# Altium schematic sheet INPUT_Module.SchDoc
size A2
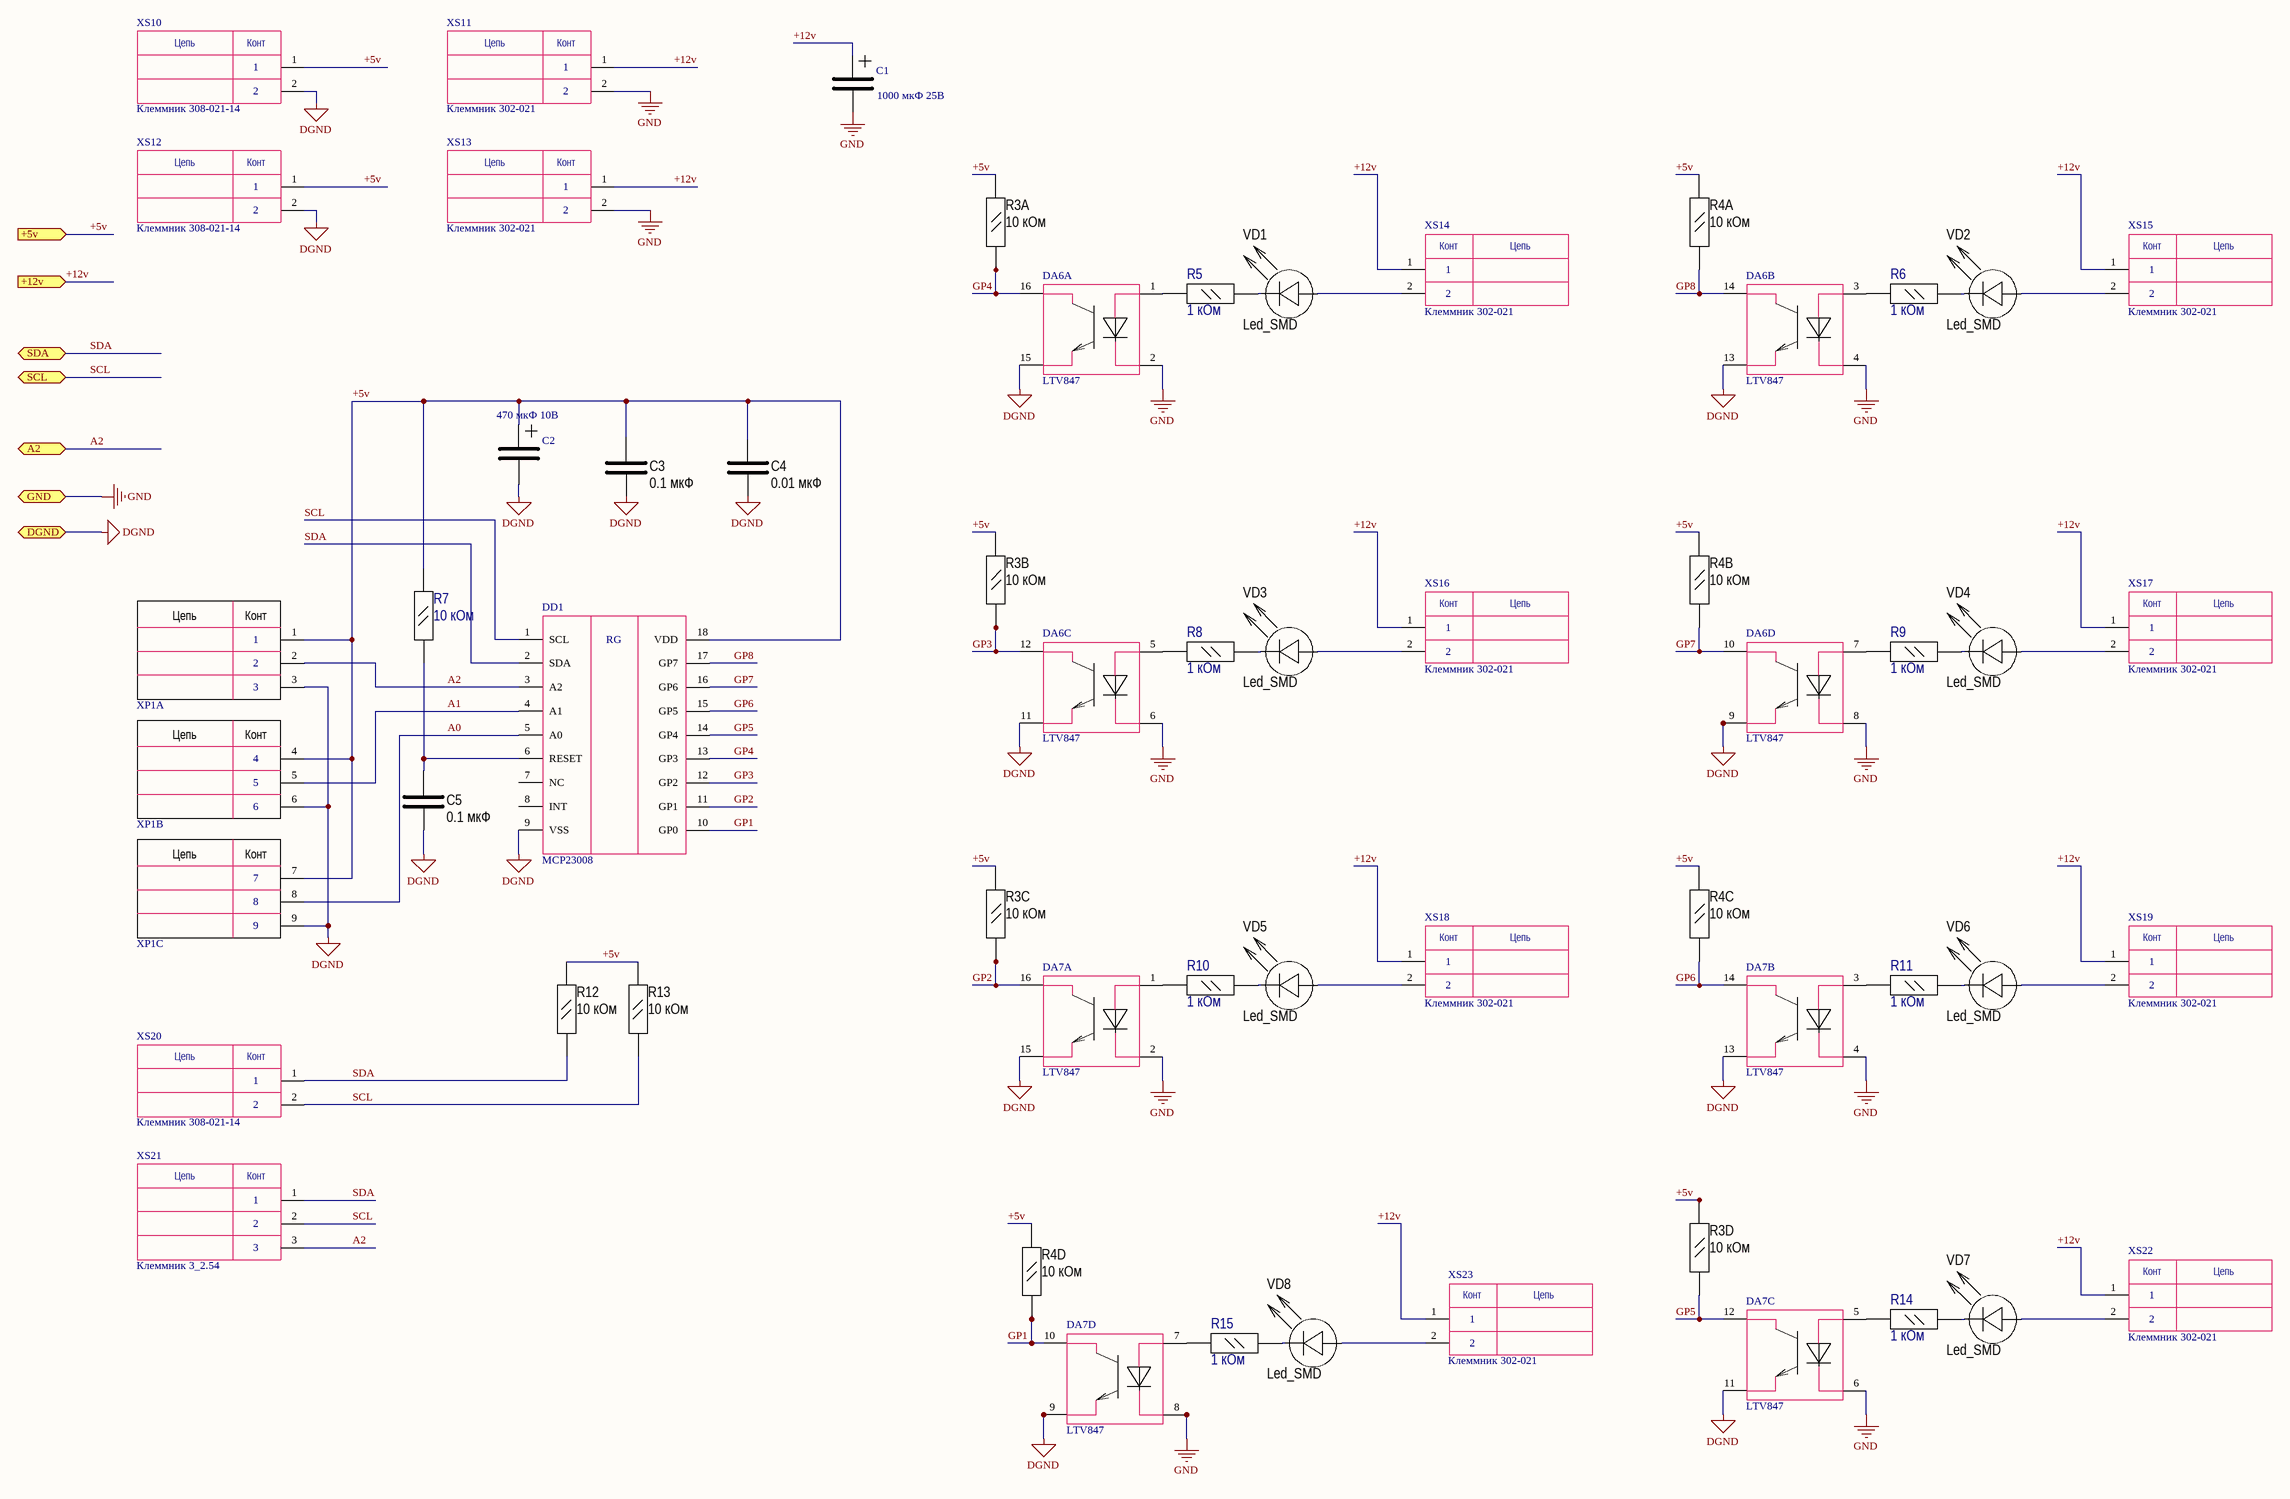
[diagram p0: INPUT_Module.SchDoc]

## Parts
C1  1000 мкФ 25В  [K50-35_10mm]
C2  470 мкФ 10В  [K50-35_6.3mm]
C3  0.1 мкФ  [C0603]
C4  0.01 мкФ  [C0603]
C5  0.1 мкФ  [C0603]
DA6  LTV847  [DIP16]  (parts A,B,C,D of 4)
DA7  LTV847  [DIP16]  (parts A,B,C,D of 4)
DD1  MCP23008  [SOIC18]
R3  10 кОм  [CAT16_F4]  (parts A,B,C,D of 4)
R4  10 кОм  [CAT16_F4]  (parts A,B,C,D of 4)
R5  1 кОм  [R0805]
R6  1 кОм  [R0805]
R7  10 кОм  [R0603]
R8  1 кОм  [R0805]
R9  1 кОм  [R0805]
R10  1 кОм  [R0805]
R11  1 кОм  [R0805]
R12  10 кОм  [R0805]
R13  10 кОм  [R0805]
R14  1 кОм  [R0805]
R15  1 кОм  [R0805]
VD1  Led_SMD  [Led0805]
VD2  Led_SMD  [Led0805]
VD3  Led_SMD  [Led0805]
VD4  Led_SMD  [Led0805]
VD5  Led_SMD  [Led0805]
VD6  Led_SMD  [Led0805]
VD7  Led_SMD  [Led0805]
VD8  Led_SMD  [Led0805]
XP1  PLS-3*3  [PLS-3*3]  (value not drawn)  (parts A,B,C of 3)
XS10  Клеммник 308-021-14  [308-021-14_2.54]
XS11  Клеммник 302-021  [301-012]
XS12  Клеммник 308-021-14  [308-021-14_2.54]
XS13  Клеммник 302-021  [301-012]
XS14  Клеммник 302-021  [301-012]
XS15  Клеммник 302-021  [301-012]
XS16  Клеммник 302-021  [301-012]
XS17  Клеммник 302-021  [301-012]
XS18  Клеммник 302-021  [301-012]
XS19  Клеммник 302-021  [301-012]
XS20  Клеммник 308-021-14  [308-021-14_2.54]
XS21  Клеммник 3_2.54  [3x2_54]
XS22  Клеммник 302-021  [301-012]
XS23  Клеммник 302-021  [301-012]

## Ports
+5v (in), +12v (in), A2, DGND (bidir), GND (bidir), SCL, SDA

## Nets
DGND: C2.2 C3.2 C4.2 C5.2 DA6.9(E) DA6.11(E) DA6.13(E) DA6.15(E) DA7.9(E) DA7.11(E) DA7.13(E) DA7.15(E) DD1.9(VSS) XP1.3 XP1.6 XP1.9 XS10.2 XS12.2 ; port DGND
GND: C1.2 DA6.2(-) DA6.4(-) DA6.6(-) DA6.8(-) DA7.2(-) DA7.4(-) DA7.6(-) DA7.8(-) XS11.2 XS13.2 ; port GND
+5v: C2.1 C3.1 C4.1 DD1.18(VDD) R3.2 R3.4 R3.6 R3.8 R4.2 R4.4 R4.6 R4.8 R7.1 R12.1 R13.1 XP1.1 XP1.4 XP1.7 XS10.1 XS12.1 ; port +5v
+12v: C1.1 XS11.1 XS13.1 XS14.1 XS15.1 XS16.1 XS17.1 XS18.1 XS19.1 XS22.1 XS23.1 ; port +12v
A0: DD1.5(A0) XP1.8
A1: DD1.4(A1) XP1.5
A2: DD1.3(A2) XP1.2 XS21.3 ; port A2
GP1: DA7.10(C) DD1.10(GP0) R4.7
GP2: DA7.16(C) DD1.11(GP1) R3.5
GP3: DA6.12(C) DD1.12(GP2) R3.3
GP4: DA6.16(C) DD1.13(GP3) R3.1
GP5: DA7.12(C) DD1.14(GP4) R3.7
GP6: DA7.14(C) DD1.15(GP5) R4.5
GP7: DA6.10(C) DD1.16(GP6) R4.3
GP8: DA6.14(C) DD1.17(GP7) R4.1
SCL: DD1.1(SCL) R13.2 XS20.2 XS21.2 ; port SCL
SDA: DD1.2(SDA) R12.2 XS20.1 XS21.1 ; port SDA
NetC5_1: C5.1 DD1.6(RESET) R7.2
NetDA6_1: DA6.1(+) R5.2
NetDA6_3: DA6.3(+) R6.2
NetDA6_5: DA6.5(+) R8.2
NetDA6_7: DA6.7(+) R9.2
NetDA7_1: DA7.1(+) R10.2
NetDA7_3: DA7.3(+) R11.2
NetDA7_5: DA7.5(+) R14.2
NetDA7_7: DA7.7(+) R15.2
NetR5_1: R5.1 VD1.1
NetR6_1: R6.1 VD2.1
NetR8_1: R8.1 VD3.1
NetR9_1: R9.1 VD4.1
NetR10_1: R10.1 VD5.1
NetR11_1: R11.1 VD6.1
NetR14_1: R14.1 VD7.1
NetR15_1: R15.1 VD8.1
NetVD1_2: VD1.2 XS14.2
NetVD2_2: VD2.2 XS15.2
NetVD3_2: VD3.2 XS16.2
NetVD4_2: VD4.2 XS17.2
NetVD5_2: VD5.2 XS18.2
NetVD6_2: VD6.2 XS19.2
NetVD7_2: VD7.2 XS22.2
NetVD8_2: VD8.2 XS23.2

Not connected (* = marked no-connect by the designer): DD1 7(NC) 8(INT)

## Notes on the sheet
- (in symbol MCP23008) RG
- (in symbol PLS-3*3, part A) Цепь; Конт
- (in symbol PLS-3*3, part B) Цепь; Конт
- (in symbol PLS-3*3, part C) Цепь; Конт
- (in symbol Клеммник 3_2.54) Цепь; Конт
- (in symbol Клеммник 302-021) Конт; Цепь
- (in symbol Клеммник 308-021-14) Цепь; Конт

## Library data of the parts
C1 = K50-35_10mm: chip-dip: 9000565924
C2 = K50-35_6.3mm
C3 C5 = Cap_SMD
C4 = C0603
R3 R4 = KAT16-F4
R5-R11 R14 R15 = ResSMD
R12 R13 = R0805
XS10 XS12 XS20 = Клеммник 308-021-14: 308-021-14_2.54
XS11 XS13-XS19 XS22 XS23 = Клеммник 302-021: 302-021-xx